# Altium schematic sheet fpga_misc.SchDoc: FPGA Misc
size Letter; SheetNumber: 6; SheetTotal: 8; SheetApproved: YES
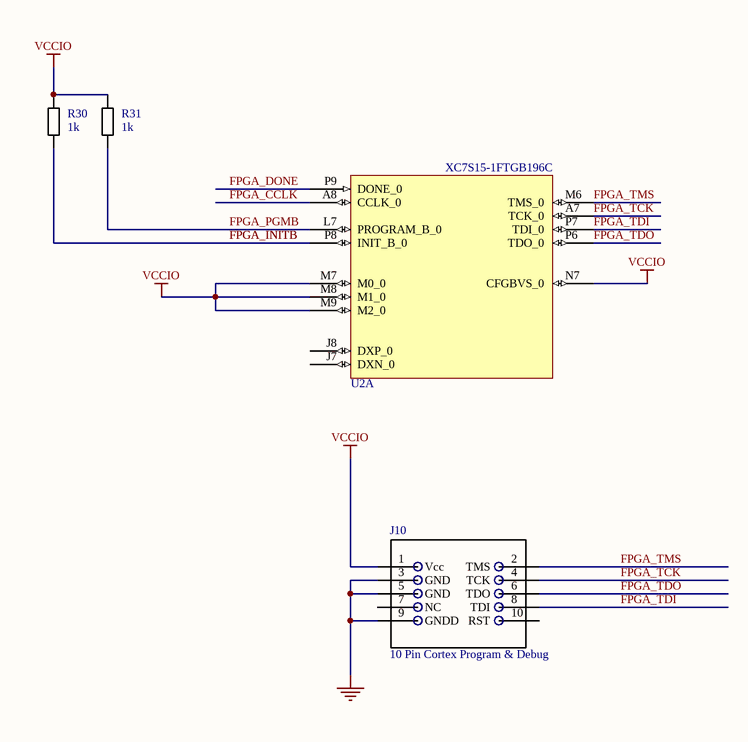
[diagram p0: fpga_misc.SchDoc]

## Parts
J10  10 Pin Cortex Program & Debug  [0.5mm_SMD_Header_5x2]
R30  1k  [RESC1608X55N]
R31  1k  [RESC1608X55N]
U2  XC7S15-1FTGB196C  [BGA_FTGB196]  (part A of 4)

## Nets
GND: J10.3(GND) J10.5(GND) J10.9(GNDD)
VCCIO: J10.1(Vcc) R30.1 R31.1 U2.M7(M0_0) U2.M8(M1_0) U2.M9(M2_0) U2.N7(CFGBVS_0)
FPGA_CCLK: U2.A8(CCLK_0)
FPGA_DONE: U2.P9(DONE_0)
FPGA_INITB: R30.2 U2.P8(INIT_B_0)
FPGA_PGMB: R31.2 U2.L7(PROGRAM_B_0)
FPGA_TCK: J10.4(TCK) U2.A7(TCK_0)
FPGA_TDI: J10.8(TDI) U2.P7(TDI_0)
FPGA_TDO: J10.6(TDO) U2.P6(TDO_0)
FPGA_TMS: J10.2(TMS) U2.M6(TMS_0)

Not connected (* = marked no-connect by the designer): J10 7(NC) 10(RST); U2 J7(DXN_0) J8(DXP_0)

## Notes on the sheet
- Title:
- Date:
- Rev:
- Time:
- Project:
- Sheet
- of
- License:
- Copyright © NewAE Technology Inc.
- Approved:
- NewAE.com
- File:

## Library data of the parts
J10 = Cortex_Debug_Header_10Pin: 10 Pin Cortex Program & Debug 0.5mm pitch; Manufacture Part Number 1: 20021121-00010C4LF; Component Group: Connector; PP Material Stack: 0; Part Number: Cortex_Debug_Header_10Pin; Pin Count: 10; Supplier 1: Digi-Key; Supplier Part Number 1: 609-3695-1-ND; Mounting Technology: SMT; RoHS: Yes; Component Kind: Standard; Component Type: Standard; PP Rotation: 0
R30 R31 = RCHIP-1K-0603: 1k res, 0603, 1%, 1/10W; Manufacture 1: Yageo; Manufacture Part Number 1: RC0603FR-071KL; Component Group: Resistor; Case-EIA: 0603; Case-Metric: 1608; Rated Power: 0.1W; Rated Voltage: 75VDC; Part Number: RCHIP-1K-0603; Footprint: 0603; Pin Count: 2; Supplier 1: Digi-Key; Supplier Part Number 1: 311-1.00KHRCT-ND; Value: 1k; Tolerance: 1%; Mounting Technology: SMT; Temperature Range: -55C to 155C; Component Kind: Standard; Component Type: Standard
U2 = XC7S15-1FTGB196C: Xilinx Spartan 7 FPGA, 196FTGB; Component Group: Digital IC; PP Material Stack: 0; Part Number: XC7S15-1FTGB196C; Manufacture 1: Xilinx; Manufacture Part Number 1: XC7S15-1FTGB196C; Pin Count: 196; Supplier 1: Digi-Key; Supplier Part Number 1: 122-2226-ND; Mounting Technology: SMT; Component Kind: Standard; Component Type: Standard; PP Rotation: 0